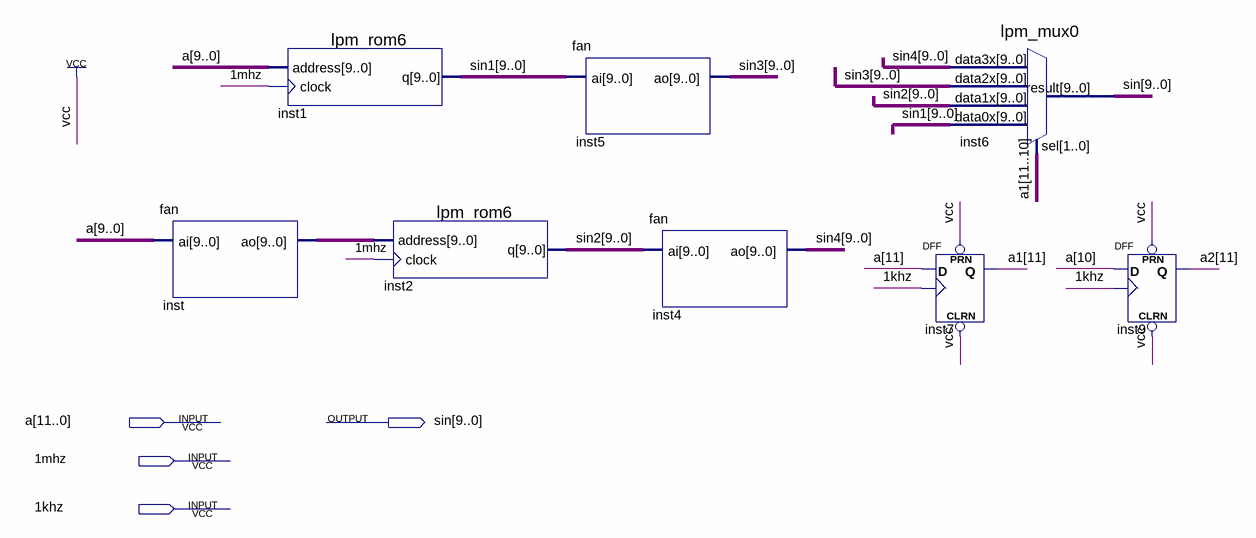
[diagram p0: schematic sheet]
// Quartus schematic ROM.bdf as structural Verilog: 8 symbols, 4 pins
module ROM (
  input  [11:0] a,
  input  \1mhz ,
  input  \1khz ,
  output [9:0] sin
);

  wire [9:0] inst_ao, sin1, sin2, sin3, sin4;
  wire [11:10] a1;
  wire [11:11] a2;

  fan inst (.ai(a[9:0]), .ao(inst_ao));
  lpm_rom6 inst1 (.address(a[9:0]), .clock(\1mhz ), .q(sin1));
  lpm_rom6 inst2 (.address(inst_ao), .clock(\1mhz ), .q(sin2));
  fan inst5 (.ai(sin1), .ao(sin3));
  fan inst4 (.ai(sin2), .ao(sin4));
  DFF inst7 (.CLRN(1'b1), .CLK(\1khz ), .D(a[11]), .PRN(1'b1), .Q(a1[11]));
  lpm_mux0 inst6 (.data3x(sin4), .data2x(sin3), .data1x(sin2), .data0x(sin1), .sel(a1), .result(sin));
  DFF inst9 (.CLRN(1'b1), .CLK(\1khz ), .D(a[10]), .PRN(1'b1), .Q(a2[11]));
endmodule
